# EAGLE design newyork001 (EAGLE 4.16)
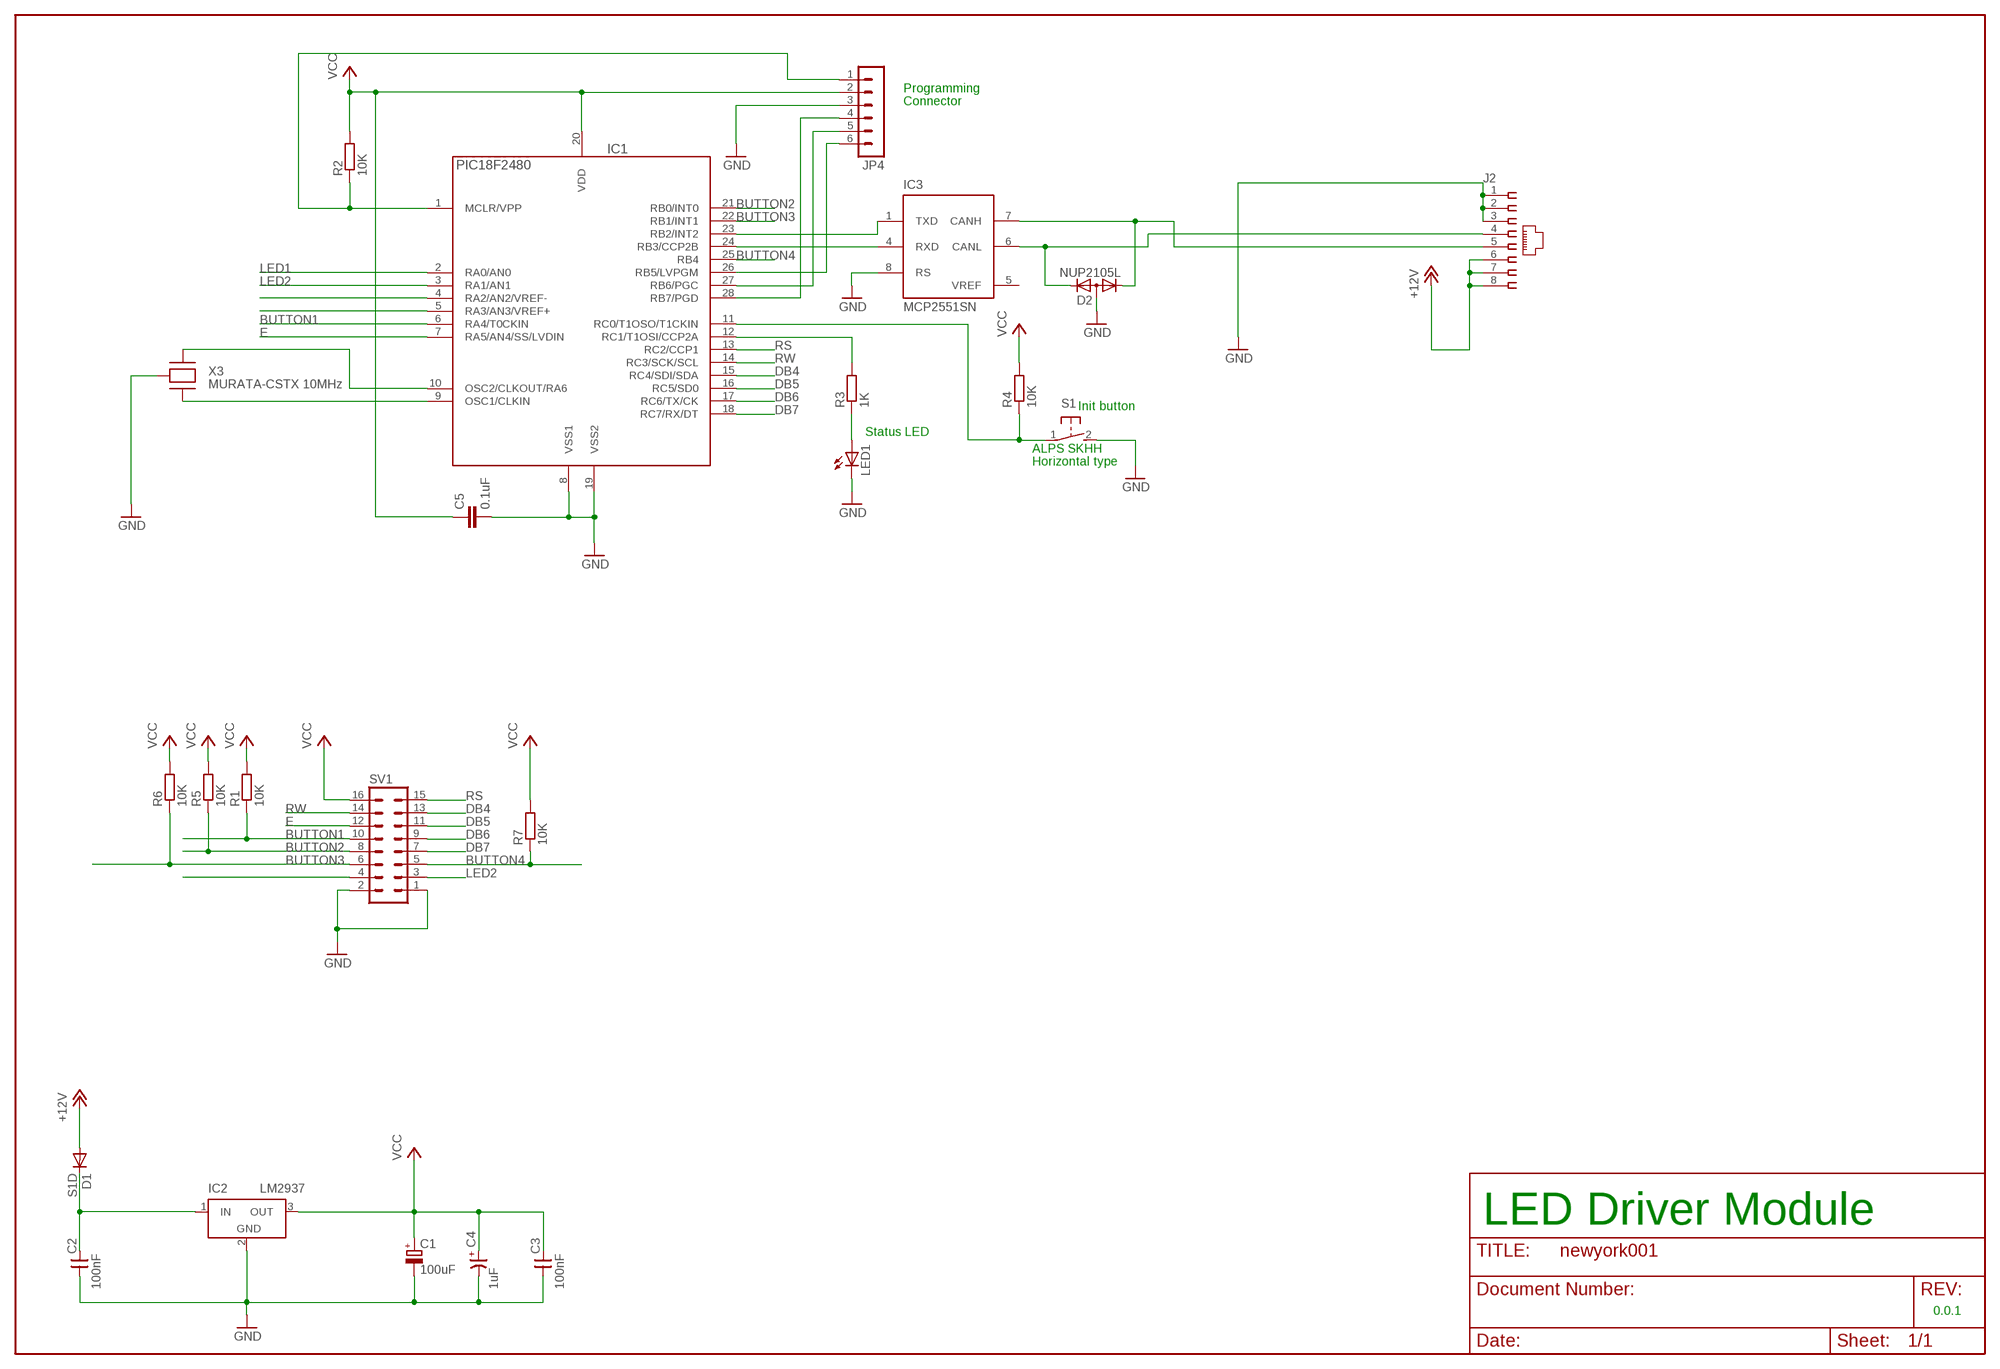
[diagram p0: schematic, sheet 1]

## Parts
C1  100uF  CPOL-EUD  [PANASONIC_D]
C2  100nF  CNP-0805  [0805]
C3  100nF  CNP-0805  [0805]
C4  1uF  CP-SV-A  [SV-A]
C5  0.1uF  C-EUC0805  [C0805]
D1  S1D  DIODE-SMB  [SMB]
D2  NUP2105L  DIODE-2CA|ACSOT23  [SOT23]
IC1  PIC18F2480  PIC18LF252-I/SO  [SO28]
IC2  LM2937  [SOT223]
IC3  MCP2551SN  [SO-08]
J2  520426-4  [520426-4]
JP4  MA06-1  [MA06-1]
LED1  LED3MM  [LED3MM]
R1  10K  R-EU_R0805  [R0805]
R2  10K  R-EU_R0805  [R0805]
R3  1K  R-EU_R0805  [R0805]
R4  10K  R-EU_R0805  [R0805]
R5  10K  R-EU_R0805  [R0805]
R6  10K  R-EU_R0805  [R0805]
R7  10K  R-EU_R0805  [R0805]
S1  31-XX  [B3F-31XX]
SV1  MA08-2  [MA08-2]
X3  MURATA-CSTX 10MHz  MURATA-CSTX  [RESONATOR-MURATA]

## Nets
+12V: D1.A J2.6 J2.7 J2.8
BUTTON1: IC1.6(RA4/T0CKIN) R1.1 SV1.10
BUTTON2: IC1.21(RB0/INT0) R5.1 SV1.8
BUTTON3: IC1.22(RB1/INT1) R6.1 SV1.6
BUTTON4: IC1.25(RB4) R7.1 SV1.5
CANH: D2.1(K1) IC3.7(CANH) J2.5
CANL: D2.2(K2) IC3.6(CANL) J2.4
DB4: IC1.15(RC4/SDI/SDA) SV1.13
DB5: IC1.16(RC5/SD0) SV1.11
DB6: IC1.17(RC6/TX/CK) SV1.9
DB7: IC1.18(RC7/RX/DT) SV1.7
E: IC1.7(RA5/AN4/SS/LVDIN) SV1.12
GND: C1.- C2.1 C3.1 C4.- C5.2 D2.3(A) IC1.8(VSS1) IC1.19(VSS2) IC2.2(GND) IC3.8(RS) J2.1 J2.2 J2.3 JP4.3 LED1.K(C) S1.2(S) SV1.1 SV1.2 X3.2(GND)
IO2: IC1.4(RA2/AN2/VREF-)
IO3: IC1.5(RA3/AN3/VREF+)
LED1: IC1.2(RA0/AN0) SV1.4
LED2: IC1.3(RA1/AN1) SV1.3
N$2: C2.2 D1.C IC2.1(IN)
N$4: IC1.12(RC1/T1OSI/CCP2A) R3.2
N$5: LED1.A R3.1
N$6: IC1.11(RC0/T1OSO/T1CKIN) R4.1 S1.1(P)
N$7: IC1.9(OSC1/CLKIN) X3.3(XTOUT)
N$12: IC1.1(MCLR/VPP) JP4.1 R2.1
N$13: IC1.28(RB7/PGD) JP4.4
N$14: IC1.27(RB6/PGC) JP4.5
N$15: IC1.26(RB5/LVPGM) JP4.6
N$16: IC1.10(OSC2/CLKOUT/RA6) X3.1(XTIN)
RS: IC1.13(RC2/CCP1) SV1.15
RW: IC1.14(RC3/SCK/SCL) SV1.14
RXCAN: IC1.24(RB3/CCP2B) IC3.4(RXD)
TXCAN: IC1.23(RB2/INT2) IC3.1(TXD)
VCC: C1.+ C3.2 C4.+ C5.1 IC1.20(VDD) IC2.3(OUT) JP4.2 R1.2 R2.2 R4.2 R5.2 R6.2 R7.2 SV1.16

## Notes on the sheet
- Programming
- Connector
- Init button
- Status LED
- ALPS SKHH
- Horizontal type
- LED Driver Module
- 0.0.1

## Power pins joined to a net without a drawn wire
GND: IC2.4(GND) IC3.2(VSS)
VCC: IC3.3(VDD)
VREF: IC3.5(VREF)

## Library data of the parts
C1 = rcl:CPOL-EU: POLARIZED CAPACITOR, European symbol
C2 C3 = cap-master:CNP-: NON-POLARIZED CAP
C4 = cap-master:CP-: POLARIZED CAP
C5 = rcl:C-EU: CAPACITOR, European symbol
D1 = diode:DIODE-: DIODE
D2 = diode:DIODE-2CA|AC: Dual DIODE Cathode-Anode|Anode-Cathode
IC1 = pic_olin:PIC18*F252-?: 18F252, 28 pin, 32Kb prog, 1536 data, 256 EEPROM
IC2 = eurosource:LM2937
IC3 = microchip_can:MCP2551: High Speed CAN tranceiver
J2 = con-amp:520426-4: AMP connector
JP4 = con-lstb:MA06-1
LED1 = led:LED: LED OSRAM: - CHIPLED LG R971, LG N971, LY N971, LG Q971, LY Q971, LO R971, LY R971 LH N974, LH R974 LS Q976, LO Q976, LY Q976 LO Q996 - Hyper CHIPLED LW Q18S LB Q993, LB Q99A, LB R99A - SideLED LS A670, LO A670, LY A670, LG A670, LP A670 LB A673, LV A673, LT A673, LW A673 LH A674 LY A675 LS A676, LA A676, LO A676, LY A676, LW A676 LS A679, LY A679, LG A679 - Hyper Micro SIDELED® LS Y876, LA Y876, LO Y876, LY Y876 LT Y87S - SmartLED LW L88C, LW L88S LB L89C, LB L89S, LG L890 LS L89K, LO L89K, LY L89K LS L896, LA L896, LO L896, LY L896 - TOPLED LS T670, LO T670, LY T670, LG T670, LP T670 LSG T670, LSP T670, LSY T670, LOP T670, LYG T670 LG T671, LOG T671, LSG T671 LB T673, LV T673, LT T673, LW T673 LH T674 LS T676, LA T676, LO T676, LY T676, LB T676, LH T676, LSB T676, LW T676 LB T67C, LV T67C, LT T67C, LS T67K, LO T67K, LY T67K, LW E67C LS E67B, LA E67B, LO E67B, LY E67B, LB E67C, LV E67C, LT E67C LW T67C LS T679, LY T679, LG T679 LS T770, LO T770, LY T770, LG T770, LP T770 LB T773, LV T773, LT T773, LW T773 LH T774 LS E675, LA E675, LY E675, LS T675 LS T776, LA T776, LO T776, LY T776, LB T776 LHGB T686 LT T68C, LB T68C - Hyper Mini TOPLED® LB M676 - Mini TOPLED Santana® LG M470 LS M47K, LO M47K, LY M47K Source: http://www.osram.convergy.de/
R1-R7 = rcl:R-EU_: RESISTOR, European symbol
S1 = switch-omron:31-XX: OMRON SWITCH
SV1 = con-lstb:MA08-2: PIN HEADER
X3 = eurosource_ftdi:MURATA-CSTX

## Board
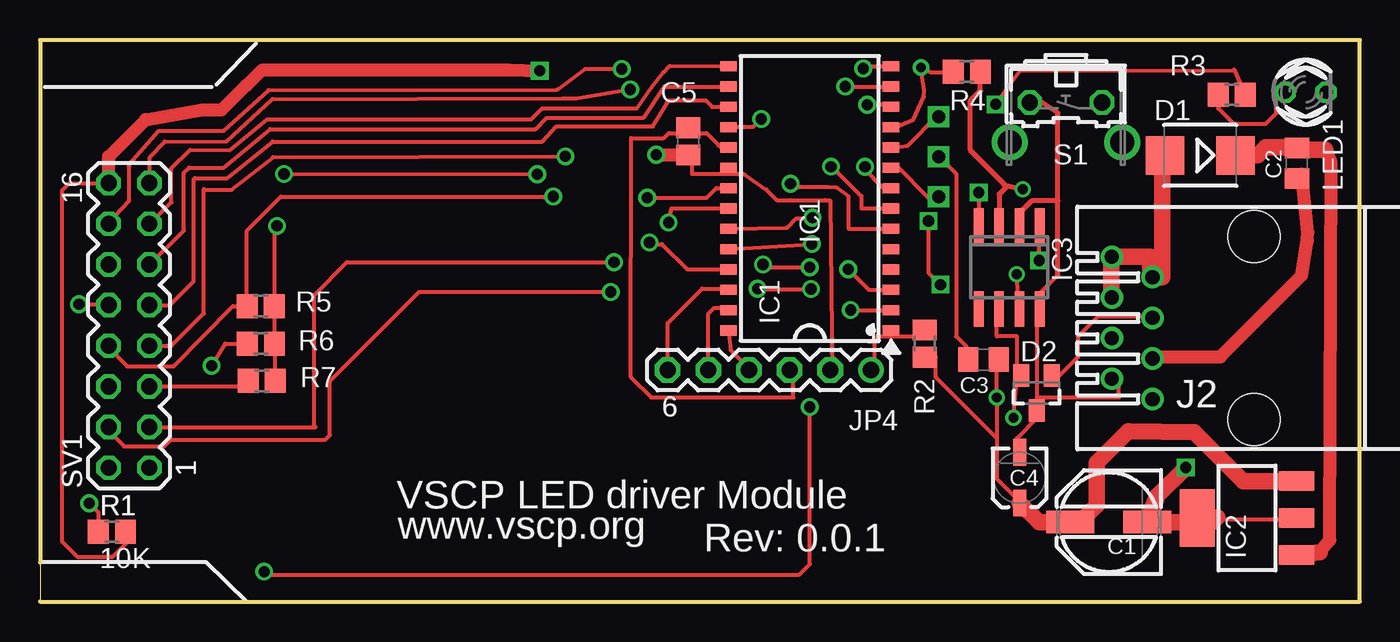
[diagram p1: board, top side]
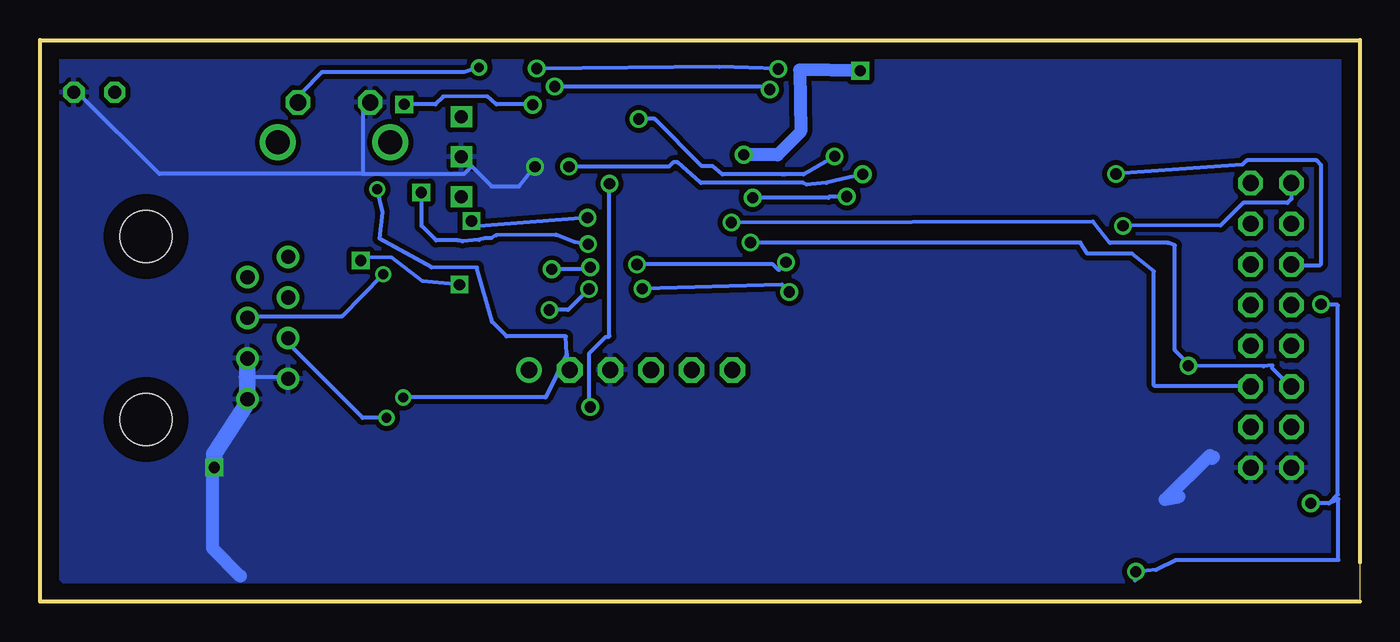
[diagram p2: board, bottom side, seen from below]

Size 82.46 x 35.08 mm. Coordinates in mm from the lower left corner, seen from the top.
Outline: 0,0 82.46,0 82.46,35.08 0,35.08 0,2.45 0,0
Copper layers (1*16): Top 0.035mm / dielectric 1.5mm / Bottom 0.035mm
Design rules "10mils": minimum track width 10mil, minimum drill 24mil, track to track 10mil, track to pad 10mil, pad to pad 10mil, via to via 10mil, smd to smd 10mil, copper to edge 40mil, drill to drill 10mil, minimum pad ring 10mil, minimum via ring 8mil, stop-mask expansion 0mil, vias tented up to drill 0mil, thermal gap 10mil

### Footprints (pad centres in the part's own frame; a part is rotated, then mirrored left to right if it is on the bottom)
PANASONIC_D = smd 3 x 1.4: + 2.4,0; - -2.4,0
0805 = smd 1.27 x 1.524: 1 -0.953,0; 2 0.953,0
SV-A = smd 1.676 x 0.813: + -1.587,0; - 1.587,0
C0805 = smd 1.3 x 1.5: 1 -0.85,0; 2 0.85,0
SMB = smd 2.4 x 2.4: A 2.2,0; C -2.2,0
SOT23 = smd 1 x 1.4: 1 -0.95,-1.1; 2 0.95,-1.1; 3 0,1.1
SO28 = smd 0.635 x 1.016: 1 -8.255,-5.08; 2 -6.985,-5.08; 3 -5.715,-5.08; 4 -4.445,-5.08; 5 -3.175,-5.08; 6 -1.905,-5.08; 7 -0.635,-5.08; 8 0.635,-5.08; 9 1.905,-5.08; 10 3.175,-5.08; 11 4.445,-5.08; 12 5.715,-5.08; 13 6.985,-5.08; 14 8.255,-5.08; 15 8.255,5.08; 16 6.985,5.08; 17 5.715,5.08; 18 4.445,5.08; 19 3.175,5.08; 20 1.905,5.08; 21 0.635,5.08; 22 -0.635,5.08; 23 -1.905,5.08; 24 -3.175,5.08; 25 -4.445,5.08; 26 -5.715,5.08; 27 -6.985,5.08; 28 -8.255,5.08
SOT223 = smd 1.219 x 2.235: 1 -2.311,-3.099; 2 0,-3.099; 3 2.311,-3.099 | smd 3.6 x 2.2: 4 0,3.099
SO-08 = smd 0.6 x 2.2: 1 -1.905,-2.6; 2 -0.635,-2.6; 3 0.635,-2.6; 4 1.905,-2.6; 5 1.905,2.6; 6 0.635,2.6; 7 -0.635,2.6; 8 -1.905,2.6
520426-4 = drill 0.889 round: 1 -4.445,6.35; 2 -3.175,8.89; 3 -1.905,6.35; 4 -0.635,8.89; 5 0.635,6.35; 6 1.905,8.89; 7 3.175,6.35; 8 4.445,8.89 | hole 3.251: -5.715,0; 5.715,0
MA06-1 = drill 1.016 pad 1.6 round: 1 -6.35,0 | drill 1.016 pad 1.6 octagon: 2 -3.81,0; 3 -1.27,0; 4 1.27,0; 5 3.81,0; 6 6.35,0
LED3MM = drill 0.813 octagon: A -1.27,0; K 1.27,0
R0805 = smd 1.3 x 1.5: 1 -0.85,0; 2 0.85,0
B3F-31XX = drill 1.016 octagon: 1 -2.261,-1.245; 2 2.261,-1.245 | drill 1.499 pad 2.159 round: 3 -3.505,1.245; 4 3.505,1.245
MA08-2 = drill 1.016 octagon: 1 -8.89,-1.27; 2 -8.89,1.27; 3 -6.35,-1.27; 4 -6.35,1.27; 5 -3.81,-1.27; 6 -3.81,1.27; 7 -1.27,-1.27; 8 -1.27,1.27; 9 1.27,-1.27; 10 1.27,1.27; 11 3.81,-1.27; 12 3.81,1.27; 13 6.35,-1.27; 14 6.35,1.27; 15 8.89,-1.27; 16 8.89,1.27
RESONATOR-MURATA = drill 0.813 square: 1 0,0; 2 2.5,0; 3 5,0

### Placement (x,y rotation side)
C1  66.77,4.96 180 top
C2  78.52,27.38 90 top
C3  58.94,15.11 0 top
C4  61.19,7.74 90 top
C5  40.5,28.75 90 top
D1  72.48,27.87 180 top
D2  62.26,13.03 180 top
IC1  48.09,25.19 90 top
IC2  75.4,5.22 90 top
IC3  60.55,20.88 180 top
J2  75.85,17.09 90 top
JP4  45.56,14.47 180 top
LED1  79.07,31.82 0 top
R1  4.49,4.36 0 top
R2  55.27,16.12 270 top
R3  74.45,31.66 0 top
R4  57.9,33.11 0 top
R5  13.79,18.46 0 top
R6  13.8,16.12 0 top
R7  13.85,13.78 0 top
S1  64.09,29.94 180 top
SV1  5.56,17.25 90 top
X3  56.13,30.28 270 top

### Tracks (layer width: path | path; a pad name or v marks a point on that pad's centre or on a via)
+12V
  Top 1.016: 66.91,21.54 66.91,21.65 | 66.91,21.54 J2.8 69.37,21.54 69.37,20.27 J2.7 70.12,20.27 70.12,27.87 D1.A | J2.6 66.91,19 66.91,21.54
BUTTON1  (via drill 0.7)
  Top 0.254: IC1.6 50.49,23.3 50.49,25.34 49.77,25.88 49.24,25.91 47.08,25.91 v46.89,26.1 | R1.1 3.64,5.57 v3.07,6.14 | SV1.10 4.43,18.52 4.46,18.55 4.44,18.57 v2.44,18.57 | v48.09,12.15 48.09,2.34 47.44,1.69 14.3,1.69 v14,1.87
  Bottom 0.254: v46.89,26.1 46.89,16.59 46.94,16.54 47.12,16.54 48.14,15.52 48.14,12.2 v48.09,12.15 | 1.93,6.14 v3.07,6.14 | 1.93,6.14 1.38,6.69 1.38,18.5 1.43,18.55 2.25,18.55 v2.44,18.57 | 13.9,1.87 12.74,1.98 11.51,2.59 1.35,2.59 1.35,6.4 1.93,6.14 | 13.9,1.87 14.05,1.32 14.05,1.53 | 13.9,1.87 v14,1.87
BUTTON2  (via drill 0.7)
  Top 0.254: IC1.21 42.25,25.82 41.65,25.22 v37.94,25.22 | 4.2,15.98 4.15,16.03 | SV1.8 4.2,15.98 | 4.2,15.98 5.44,14.69 8.35,14.69 12.05,18.46 R5.1 12.79,18.46 | v32.06,25.3 15.05,25.3 12.92,23.17 12.92,18.59 12.79,18.46 | 12.79,18.46 12.77,18.44
  Bottom 0.254: v37.94,25.22 33.21,25.22 33.13,25.3 v32.06,25.3
BUTTON3  (via drill 0.7)
  Top 0.254: R6.1 11.56,16.12 v10.72,14.73 | IC1.22 39.46,24.55 39.25,23.67 39.21,23.7 v39.27,23.68
  Bottom 0.254: SV1.6 4.35,13.44 5.47,14.56 5.47,14.76 6.04,14.69 v10.72,14.73 10.69,14.84 | v39.27,23.68 16.67,23.73 15.62,22.41 11.99,22.41 11.56,22.25 11.56,15.71 10.69,14.84 | 10.69,14.84 10.61,14.76
BUTTON4  (via drill 0.7)
  Top 0.254: R7.1 12.93,13.78 12.92,13.79 12.57,13.44 SV1.5 | IC1.25 40.43,20.75 38.85,22.33 38.17,22.33 v38.07,22.43
  Bottom 0.254: v38.07,22.43 17.46,22.43 17.03,21.73 14.25,21.73 12.88,20.63 12.88,13.52 12.82,13.46 6.7,13.46 6.68,13.44 SV1.5
CANH  (via drill 0.61)
  Top 0.254: D2.1 63.58,14.02 64.85,15.29 64.85,16.56 66.12,17.83 69.93,17.83 J2.5 | v61.02,20.45 61.04,19.1 IC3.7
  Bottom 0.254: v61.02,20.45 63.58,17.83 69.93,17.83 J2.5
CANL  (via drill 0.61)
  Top 0.254: 61.04,14.02 61.04,16.56 59.77,16.56 59.77,17.83 IC3.6 | v60.81,11.48 61.04,14.02 | 61.04,14.02 D2.2
  Bottom 0.254: v60.81,11.48 62.31,11.48 67.39,16.56 J2.4
DB4
  Top 0.254: SV1.13 6.87,23.6 8.21,24.94 8.21,27.06 9.37,28.22 11.86,28.2 14.19,30.13 30.68,30.12 31.37,30.81 33.06,30.81 37.3,30.83 38.21,32.12 38.92,33.05 39.34,33.46 IC1.15 | IC1.15 43.02,33.43 | IC1.15
DB5
  Top 0.254: IC1.16 38.99,32.17 37.71,30.23 33.94,30.21 31.65,30.21 30.96,29.52 14.38,29.51 11.48,27.11 9.32,27.11 8.99,26.78 8.99,23.18 6.87,21.06 SV1.11
DB6
  Top 0.254: IC1.17 41.99,30.91 41.59,31.31 39.28,31.31 38.28,29.68 34.22,29.68 33.6,29.69 32.26,29.69 31.36,28.73 14.53,28.74 11.71,26.46 9.68,26.46 9.59,26.37 9.59,20 8.11,18.52 SV1.9 6.64,18.52
DB7  (via drill 0.7)
  Top 0.254: IC1.18 44.53,29.64 v45.05,30.15 | v32.82,27.81 14.56,27.76 11.95,25.72 10.29,25.72 10.24,25.77 10.24,18.01 8.21,15.98 6.73,15.98 | SV1.7 6.73,15.98 | 6.73,15.98 6.64,15.89
  Bottom 0.254: v45.05,30.15 44.07,30.15 41.12,27.2 40.44,27.2 39.83,26.68 36.09,26.68 35.91,26.69 34.75,26.69 v32.82,27.81
E  (via drill 0.7)
  Top 0.254: IC1.7 51.3,24.55 51.3,25.32 49.46,27.17 v49.42,27.17 | v31.06,26.7 15.22,26.71 v15.24,26.71
  Bottom 0.254: v49.42,27.17 43.17,27.17 42.91,27.43 42.62,27.43 41.18,26.16 34.77,26.16 34.59,26.05 33.33,26.15 v31.06,26.7 | v15.24,26.71 7.34,27.29 7.07,27.56 2.71,27.56 2.42,27.27 2.42,21.09 2.52,20.99 4.41,20.99 4.44,21.02 4.4,21.06 SV1.12
GND  (via drill 0.7)
  Top 0.254: 40.72,29.26 39.29,29.26 38.98,28.95 36.93,28.95 36.91,14.02 38.18,12.75 47.07,12.75 47.07,14.02 JP4.3 | 40.72,29.26 C5.2 | C3.1 58.5,15.29 57.23,16.56 57.23,26.72 55.96,27.99 X3.2 56.13,27.81 56.24,27.92 | 62.31,11.48 61.04,10.21 61.04,8.94 C4.- | 62.31,11.48 62.31,12.75 | 62.31,12.75 62.31,17.83 IC3.8 62.31,19.1 63.58,20.37 | 62.31,11.48 D2.3 | 62.31,12.75 67.39,12.75 67.39,14.02 J2.2 | 43.2,28.48 43.27,28.42 | 43.2,28.48 IC1.19 42.63,28.37 42.59,28.32 41.65,29.26 40.72,29.26 | 42.4,28.5 43.19,28.5 43.2,28.48 | IC2.2 77.55,5.13 73.74,5.13 73.23,4.96 | 78.82,26.72 C2.1 | J2.3 69.93,15.29 | v51.54,27.16 51.37,27.16 51.36,27.15 52.68,25.82 IC1.8
  Top 0.305: 63.58,20.37 63.58,25.06 | 63.58,25.06 63.58,30.53 62.4,31.31 S1.2 | 61.18,24.25 61.97,25.03 63.47,25.03 63.5,25.06 63.58,25.06
  Top 0.406: 61.18,24.25 IC3.2
  Top 0.813: 78.82,26.72 79.2,23.06 79.18,22.57 78.82,20.37 73.74,15.29 69.93,15.29
  Top 1.016: v71.58,8.37 69.81,6.6 C1.- 73.03,4.96 72.99,5 IC2.4 72.99,5.2 73.23,4.96 73.53,5.26
  Bottom 0.254: X3.2 56.09,27.78 55.49,27.19 | 55.49,27.19 54.25,25.94 52.53,25.94 v51.54,27.16 | J2.2 67.39,14.02 69.5,14.02 69.93,14.02 | 62.31,26.72 55.96,26.72 55.49,27.19 | 62.31,26.72 75.01,26.72 80.09,31.8 LED1.K | 62.31,26.72 62.31,31.28 S1.2 | v71.58,8.37 71.2,8.94 71.7,8.31
  Bottom 0.813: 71.7,8.31 71.7,3.35 69.94,1.59 | 11.31,6.56 12.18,6.39 9.37,9.13 9.37,9.08 9.24,8.95 9.15,9.04
  Bottom 1.016: J2.1 69.5,14.02 J2.3 | J2.1 69.5,12.55 69.52,12.53 | J2.1 69.39,12.65 69.37,12.63 71.58,9.22 v71.58,8.37
  pour Bottom (isolate 0.305): 0.67,34.09 0.67,1.45 1.26,0.86 80.55,0.86 81.52,1.83 81.52,34.32 81.59,34.39 1.04,34.39 0.82,34.17
LED1  (via drill 0.7)
  Top 0.254: IC1.2 50.66,18.21 v50.64,18.22 | v48.17,19.52 45.1,19.52 v44.83,19.54 | v35.65,19.34 23.69,19.34 18.1,13.75 18.1,10.39 17.82,10.11 8.18,10.11 7.76,9.69 5.25,9.69 4.18,10.76 4.29,10.87 SV1.4
  Bottom 0.254: v50.64,18.22 49.47,18.22 v48.17,19.52 | v44.83,19.54 36.11,19.8 v35.65,19.34
LED2  (via drill 0.7)
  Top 0.254: IC1.3 51.77,19.48 v50.49,20.76 | v35.86,21.2 19.17,21.2 17.12,19.15 17.12,10.99 17.21,10.9 6.74,10.9 | SV1.3 6.74,10.9 | 6.74,10.9 6.69,10.95 | v48.09,20.89 45.33,20.89 v45.16,21.06
  Bottom 0.254: v35.86,21.2 36.3,20.76 36.3,20.71 36.31,20.7 36.67,21.06 v45.16,21.06 | v50.49,20.76 48.22,20.76 v48.09,20.89
N$2
  Top 0.813: 79.96,3.07 80.58,3.83 80.66,27.47 80.29,28.22
  Top 1.016: D1.C 76.08,27.87 76.58,28.37 78.49,28.37 C2.2 78.64,28.22 80.29,28.22 | IC2.1 79.96,3.07
N$4  (via drill 0.7)
  Top 0.254: R3.2 74.59,33.23 74.65,33.19 61.23,33.16 v59.7,31.06 | 53.38,31.03 53.39,31.01 | IC1.12 53.38,31.03 | v51.68,31.03 53.37,31.03 53.38,31.03
  Bottom 0.254: v59.7,31.06 57.76,31.06 57.28,31.54 54.52,31.56 53.95,31.06 51.42,31.06 v51.68,31.03
N$5
  Top 0.254: R3.1 73.6,30.81 74.57,29.84 76.56,29.84 77.24,30.52 77.24,31.35 77.75,31.86 LED1.A
N$6  (via drill 0.61)
  Top 0.254: R4.1 57.23,33.07 55.66,33.06 v55.03,33.37 55.23,31.9 55.21,31.55 54.54,30.09 53.73,29.75 IC1.11
  Bottom 0.254: v55.03,33.37 55.96,33.07 64.85,33.07 66.12,31.8 S1.1
N$7
  Top 0.254: IC1.9 53.52,27.21 55.5,25.24 56.23,25.24 56.26,25.27 56.25,25.28 X3.3
N$12
  Top 0.254: 53.64,16.56 52.15,16.56 52.15,14.02 JP4.1 | 53.64,16.56 54.69,16.56 R2.1 | IC1.1 53.3,16.9 53.64,16.56
N$13
  Top 0.254: 44.38,14.47 44.42,14.43 | 44.38,14.47 JP4.4 | IC1.28 43.14,15.71 44.38,14.47
N$14
  Top 0.254: JP4.5 41.75,17.98 42.11,18.34 43.22,18.34 43.2,18.32 IC1.27
N$15
  Top 0.254: JP4.6 39.21,17.4 41.36,19.55 43.07,19.55 43.12,19.6 IC1.26
N$16
  Top 0.254: X3.1 56.06,30.35 54.2,28.48 IC1.10
RS  (via drill 0.7)
  Top 0.254: IC1.13 v50.3,32.17 | v36.87,31.99 33.53,31.44 32.64,31.44 14.51,31.39 11.67,28.77 7.78,28.74 6.87,27.77 6.87,26.05 6.83,26.01 | 6.83,26.01 6.78,25.96 | SV1.15 6.83,26.01
  Bottom 0.254: v50.3,32.17 36.88,32.17 v36.87,31.99
RW  (via drill 0.7)
  Top 0.254: IC1.14 51.48,33.45 v51.43,33.3 | v36.34,33.27 34.06,33.28 32.3,31.98 14.28,31.95 11.47,29.41 8.69,29.4 8.58,29.41 7.43,29.41 5.56,27.32 5.56,25.03 4.22,23.6 | 4.22,23.6 4.2,23.58 | SV1.14 4.22,23.6
  Bottom 0.254: v51.43,33.3 40.02,33.41 v36.34,33.27
RXCAN  (via drill 0.7)
  Top 0.254: IC1.24 48.66,22.37 v48.22,22.33 | IC3.4 58.62,23.47 | IC3.4 | v58.64,25.56 IC3.4
  Bottom 0.254: v48.22,22.33 49.05,22.45 50.25,22.91 53.98,22.87 54.27,22.71 54.66,22.71 55.04,22.6 56.06,22.5 56.36,22.56 57.71,22.56 58.62,23.47 58.62,25.37 v58.64,25.56
TXCAN  (via drill 0.7)
  Top 0.254: IC1.23 46.68,23.36 47.25,23.94 48.53,23.94 v48.26,23.98 | v55.5,23.77 55.5,20.55 v56.25,19.8 | IC3.1 62.45,23.45 62.43,23.42 v62.42,21.31
  Bottom 0.254: v48.26,23.98 55.47,23.4 v55.5,23.77 | v56.25,19.8 58.58,20.01 60.5,21.49 62.14,21.51 v62.42,21.31
VCC  (via drill 0.61, 0.7)
  Top 0.254: 59.77,10.21 v59.77,12.75 59.77,15.29 C3.2 | 59.77,10.21 59.77,7.67 61.04,6.4 C4.+ | 43.09,27.13 IC1.20 | 43.09,27.13 43.14,27.15 43.13,27.14 43.06,27.21 | 59.77,10.21 55.96,14.02 55.96,15.29 R2.2 | 43.1,26.72 40.72,26.72 40.72,27.99 C5.1 | 15.32,33.21 15.32,33.07 | 29.29,33.22 29.29,33.07 | 21.67,33.21 21.67,33.07 | 43.1,26.72 43.96,26.72 44,26.68 45.38,25.74 46.04,25.08 46.88,25.08 48.37,25.07 49.04,25.08 49.36,25.06 49.49,14.02 JP4.2 | 43.1,26.72 43.09,27.13 | 24.21,33.21 24.21,33.07 | SV1.16 1.84,26.14 1.38,25.68 1.38,3.75 2.32,2.81 4.53,2.81 5.44,3.72 5.44,4.34 5.42,4.36 R1.2 | 14.71,16.12 14.72,16.11 | 14.71,16.12 R6.2 14.65,13.73 R7.2 | 14.71,16.12 14.64,16.19 R5.2 14.64,23.35 v14.81,23.47
  Top 0.305: v61.4,25.76 60.59,25.92 60.26,26.01 | 60.26,26.01 60.21,26.03 60.42,25.95 59.91,25.45 IC3.3 | R4.2 58.75,31.91 58.12,31.28 58.12,28.2 60.27,26.05 60.26,26.04 60.26,26.01
  Top 0.813: C5.1 v38.51,27.9 v38.5,27.91 | v31.22,33.16 29.29,33.22 24.21,33.21 21.67,33.21 15.32,33.21 13.89,33.21 12.9,32.24 12.87,32.24 11.34,30.71 10.12,30.71 6.59,30.1 4.29,27.8 SV1.16
  Top 1.016: C4.+ 61.22,6.15 62.41,4.96 C1.+ 65.01,5.01 66.01,6.01 66.01,8.67 67.97,10.63 72.1,10.57 75.16,7.51 IC2.3
  Bottom 0.254: v61.4,25.76 61.05,24.33 61.24,22.68 58,20.87 55.17,20.86 54.22,17.47 53.31,16.56 49.61,16.56 49.55,15.46 | 49.55,15.46 50.88,12.75 v59.77,12.75 | JP4.2 49.55,15.46 | v14.81,23.47 8.7,23.5 7.29,24.91 4.53,24.91 4.28,25.16 4.28,26.03 4.35,26.1 4.31,26.14 SV1.16
  Bottom 0.813: v38.5,27.91 36.38,27.91 34.94,29.35 35.01,33.21 v31.22,33.16

### Text on the board
tNames: 16 | 1 | 6 | 1 | SV1 | VSCP LED driver Module | R1 | www.vscp.org | Rev: 0.0.1 | 10K